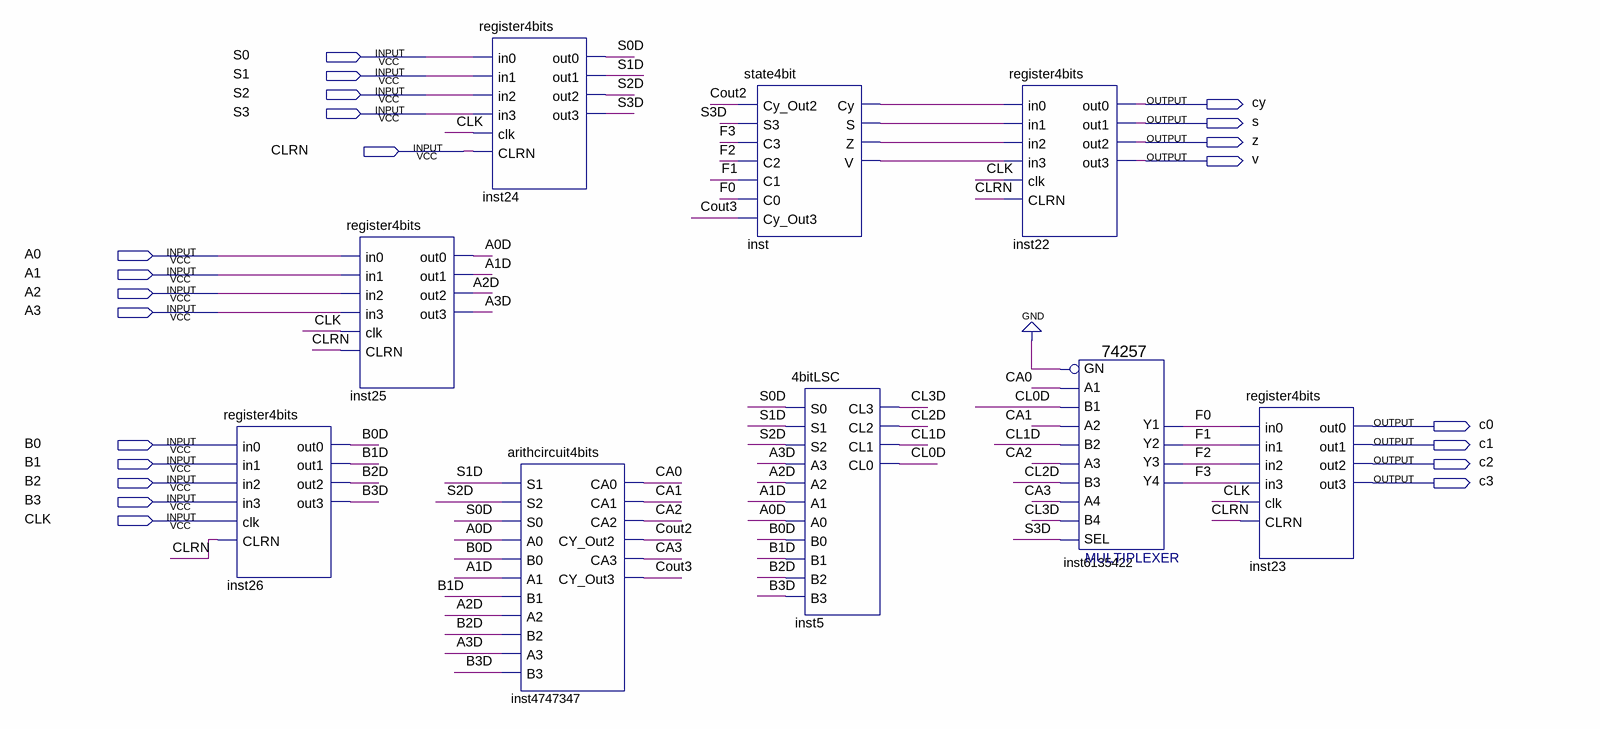
[diagram p0: schematic sheet]
// Quartus schematic ALU.bdf as structural Verilog: 9 symbols, 22 pins
module ALU (
  input  S0,
  input  S1,
  input  S2,
  input  S3,
  input  CLRN,
  input  A0,
  input  A1,
  input  A2,
  input  A3,
  input  B0,
  input  B1,
  input  B2,
  input  B3,
  input  CLK,
  output cy,
  output s,
  output z,
  output v,
  output c0,
  output c1,
  output c2,
  output c3
);

  wire A0D, A1D, A2D, A3D, B0D, B1D, B2D, B3D, CA0, CA1, CA2, CA3, CL0D, CL1D, CL2D, CL3D, Cout2, Cout3, F0,
       F1, F2, F3, inst_cy, inst_s, inst_v, inst_z, S0D, S1D, S2D, S3D;

  register4bits inst26 (
    .in0(B0), .in1(B1), .in2(B2), .in3(B3), .clk(CLK), .CLRN(CLRN), .out0(B0D), .out1(B1D), .out2(B2D),
    .out3(B3D));
  register4bits inst25 (
    .in0(A0), .in1(A1), .in2(A2), .in3(A3), .clk(CLK), .CLRN(CLRN), .out0(A0D), .out1(A1D), .out2(A2D),
    .out3(A3D));
  register4bits inst24 (
    .in0(S0), .in1(S1), .in2(S2), .in3(S3), .clk(CLK), .CLRN(CLRN), .out0(S0D), .out1(S1D), .out2(S2D),
    .out3(S3D));
  arithcircuit4bits inst4747347 (
    .S1(S1D), .S2(S2D), .S0(S0D), .A0(A0D), .B0(B0D), .A1(A1D), .B1(B1D), .A2(A2D), .B2(B2D), .A3(A3D),
    .B3(B3D), .CA0(CA0), .CA1(CA1), .CA2(CA2), .CY_Out2(Cout2), .CA3(CA3), .CY_Out3(Cout3));
  state4bit inst (
    .Cy_Out2(Cout2), .S3(S3D), .C3(F3), .C2(F2), .C1(F1), .C0(F0), .Cy_Out3(Cout3), .Cy(inst_cy), .S(inst_s),
    .Z(inst_z), .V(inst_v));
  \4bitLSC  inst5 (
    .S0(S0D), .S1(S1D), .S2(S2D), .A3(A3D), .A2(A2D), .A1(A1D), .A0(A0D), .B0(B0D), .B1(B1D), .B2(B2D),
    .B3(B3D), .CL3(CL3D), .CL2(CL2D), .CL1(CL1D), .CL0(CL0D));
  register4bits inst22 (
    .in0(inst_cy), .in1(inst_s), .in2(inst_z), .in3(inst_v), .clk(CLK), .CLRN(CLRN), .out0(cy), .out1(s),
    .out2(z), .out3(v));
  \74257  inst6135422 (
    .B1(CL0D), .A1(CA0), .B3(CL2D), .A2(CA1), .B2(CL1D), .A3(CA2), .A4(CA3), .B4(CL3D), .SEL(S3D), .GN(1'b0),
    .Y2(F1), .Y3(F2), .Y4(F3), .Y1(F0));
  register4bits inst23 (
    .in0(F0), .in1(F1), .in2(F2), .in3(F3), .clk(CLK), .CLRN(CLRN), .out0(c0), .out1(c1), .out2(c2), .out3(c3));
endmodule
